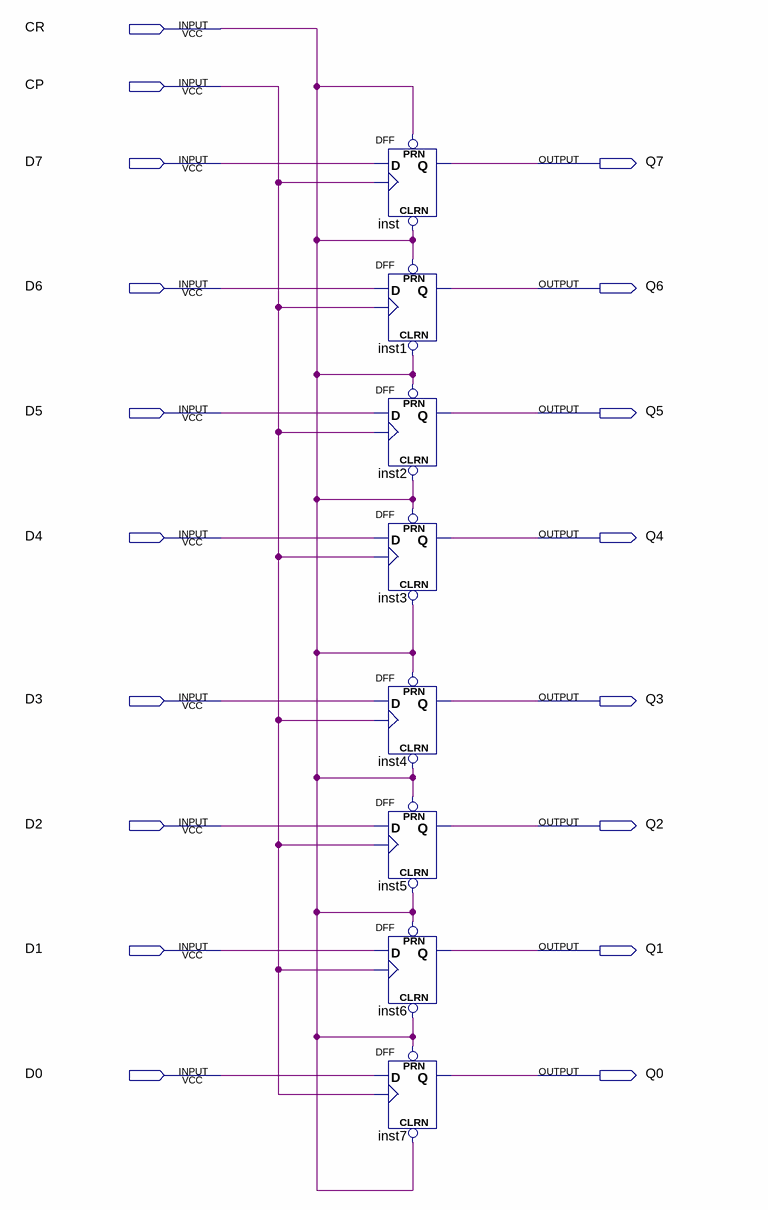
[diagram p0: schematic sheet]
// Quartus schematic register-8.bdf as structural Verilog: 8 symbols, 18 pins
module \register-8  (
  input  CR,
  input  CP,
  input  D7,
  input  D6,
  input  D5,
  input  D4,
  input  D3,
  input  D2,
  input  D1,
  input  D0,
  output Q7,
  output Q6,
  output Q5,
  output Q4,
  output Q3,
  output Q2,
  output Q1,
  output Q0
);

  DFF inst (.CLRN(CR), .CLK(CP), .D(D7), .PRN(CR), .Q(Q7));
  DFF inst1 (.CLRN(CR), .CLK(CP), .D(D6), .PRN(CR), .Q(Q6));
  DFF inst2 (.CLRN(CR), .CLK(CP), .D(D5), .PRN(CR), .Q(Q5));
  DFF inst3 (.CLRN(CR), .CLK(CP), .D(D4), .PRN(CR), .Q(Q4));
  DFF inst4 (.CLRN(CR), .CLK(CP), .D(D3), .PRN(CR), .Q(Q3));
  DFF inst5 (.CLRN(CR), .CLK(CP), .D(D2), .PRN(CR), .Q(Q2));
  DFF inst6 (.CLRN(CR), .CLK(CP), .D(D1), .PRN(CR), .Q(Q1));
  DFF inst7 (.CLRN(CR), .CLK(CP), .D(D0), .PRN(CR), .Q(Q0));
endmodule
